# Altium schematic sheet Boost 12V.SchDoc
size A4; SheetNumber: 3; SheetTotal: 12
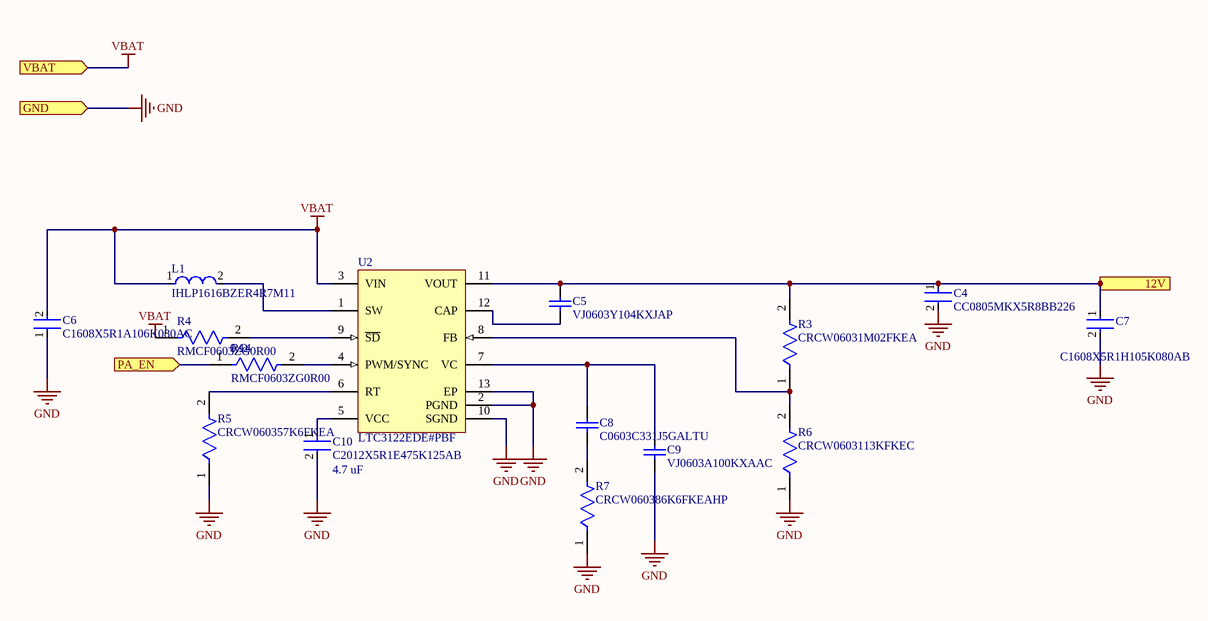
[diagram p0: Boost 12V.SchDoc]

## Parts
C4  CC0805MKX5R8BB226  [FP-CC0805-0_2-1_45-IPC_C]
C5  VJ0603Y104KXJAP  [CAPC1608X92X38NL15T08]
C6  C1608X5R1A106K080AC  [FP-C1608-080-0_1-MFG]
C7  C1608X5R1H105K080AB  [FP-C1608-080-0_1-IPC_B]
C8  C0603C331J5GALTU  [CAPC1608X87X35NL15T15]
C9  VJ0603A100KXAAC  [CAPC1608X92X38ML12T08]
C10  C2012X5R1E475K125AB  [FP-C2012-125-0_2-MFG]
L1  IHLP1616BZER4R7M11  [FP-IHLP-1616BZ-FP_1_8545x-MFG]
R3  CRCW06031M02FKEA  [FP-CRCW0603-e3-IPC_A]
R4  RMCF0603ZG0R00  [FP-RMCF0603-IPC_B]
R5  CRCW060357K6FKEA  [FP-CRCW0603-e3-MFG]
R6  CRCW0603113KFKEC  [FP-CRCW0603-e3-MFG]
R7  CRCW060386K6FKEAHP  [FP-CRCW0603-HPe3-MFG]
R14  RMCF0603ZG0R00  [FP-RMCF0603-IPC_B]
U2  LTC3122EDE#PBF  [LT-DE-UE-12_V]

## Ports
12V (out), GND (in), PA_EN (in), VBAT (in)

## Nets
GND: C4.2 C6.1 C7.2 C9.1 C10.2 R5.1 R6.1 R7.1 U2.2(PGND) U2.10(SGND) U2.13(EP) ; port GND
VBAT: C6.2 L1.1 R4.1 U2.3(VIN) ; port VBAT
12V: C4.1 C5.2 C7.1 R3.2 U2.11(VOUT) ; port 12V
PA_EN: R14.1 ; port PA_EN
NetC5_1: C5.1 U2.12(CAP)
NetC8_1: C8.1 R7.2
NetC8_2: C8.2 C9.2 U2.7(VC)
NetC10_1: C10.1 U2.5(VCC)
NetL1_2: L1.2 U2.1(SW)
NetR3_1: R3.1 R6.2 U2.8(FB)
NetR4_2: R4.2 U2.9(~{SD})
NetR5_2: R5.2 U2.6(RT)
NetR14_2: R14.2 U2.4(PWM/SYNC)

## Notes on the sheet
- 0 Ω
- (near C10) 4.7 uF

## Library data of the parts
C4 = CMP-03422-001497-1: CAP CER 22UF 25V X5R 0805; Tolerance: 20%; Max Operating Temperature: 85°C; Dielectric: X5R; Termination: SMD/SMT; Voltage Rating: 25V; Width: 0.049inch; Min Operating Temperature: -55°C; Case/Package: 0805; Lead Free: Lead Free; RoHS Compliant: Yes; Weight: 0.000194oz; Voltage Rating (DC): 25V; Capacitance: 22uF; Length: 0.079inch; Halogen Free: Halogen Free; Height: 1.25mm; Packaging: Tape and Reel; Package Quantity: 3000; Case Code (Metric): 2012; Thickness: 0.057inch; Case Code (Imperial): 0805; Mount: Surface Mount
C5 = CMP-2006-01211-1: Manufacturer: Vitramon; Part Number: VJ0603Y104KXJAP
C6 = CMP-2000-04979-3: Multilayer Ceramic Capacitors 10μF ±10% 10V X5R SMD 0603; Capacitance: 10uF; Dielectric Material: Ceramic; Construction: Flat; Height: 0.8mm; Thickness: 0.035inch; Case Code (Metric): 1608; Radiation Hardening: No; Number of Pins: 2; Voltage Rating (DC): 10V; Depth: 0.8mm; Voltage: 10V; RoHS Compliant: Yes; Voltage Rating: 10V; Package Quantity: 1; Resistor Type: Ceramic; Termination: SMD/SMT; Lead Free: Lead Free; REACH SVHC: No SVHC; Tolerance: 10%; Mount: Surface Mount; Series: C; Packaging: Tape and Reel; Width: 0.8mm; Dielectric: X5R; Weight: 7.1E-05oz; Length: 1.6mm; Max Operating Temperature: 85°C; Case Code (Imperial): 0603; Case/Package: 0603; Min Operating Temperature: -55°C
C7 = CMP-2000-06025-2: Multilayer Ceramic Capacitors 1μF ±10% 50V X5R SMD 0603; Capacitance: 1uF; Lead Free: Lead Free; Height: 0.8mm; Mount: Surface Mount; Radiation Hardening: No; Thickness: 0.035inch; Length: 1.6mm; Max Operating Temperature: 85°C; REACH SVHC: No SVHC; Min Operating Temperature: -55°C; Construction: Flat; RoHS Compliant: Yes; Voltage Rating: 50V; Dielectric: X5R; Packaging: Tape and Reel; Termination: SMD/SMT; Voltage Rating (DC): 50V; Case Code (Imperial): 0603; Voltage: 50V; Width: 0.031inch; Weight: 7.1E-05oz; Depth: 0.8mm; Case Code (Metric): 1608; Series: C; Case/Package: 0603; Tolerance: 10%; Resistor Type: Ceramic; Number of Pins: 2; Dielectric Material: Ceramic; Package Quantity: 1
C8 = CMP-2006-03564-1: Manufacturer: Kemet; Part Number: C0603C331J5GALTU
C9 = CMP-2006-02012-1: Manufacturer: Vitramon; Part Number: VJ0603A100KXAAC
C10 = CMP-08246-004908-1: Multilayer Ceramic Capacitors 4.7μF ±10% 25V X5R SMD 0805; Capacitance: 4.7uF; Lead Free: Lead Free; Thickness: 0.057inch; Packaging: Tape and Reel; Min Operating Temperature: -55°C; RoHS Compliant: Yes; Dielectric: X5R; Weight: 0.000194oz; REACH SVHC: No SVHC; Voltage Rating (DC): 25V; Mount: Surface Mount; Resistor Type: Ceramic; Termination: SMD/SMT; Number of Pins: 2; Case Code (Imperial): 0805; Dielectric Material: Ceramic; Voltage: 25V; Voltage Rating: 25V; Case Code (Metric): 2012; Case/Package: 0805; Max Operating Temperature: 85°C; Height: 1.25mm; Tolerance: 10%; Depth: 1.25mm; Package Quantity: 1; Length: 2mm; Radiation Hardening: No; Width: 1.25mm
L1 = CMP-02424-000576-1: Fixed Inductors Commercial Low DCR Series SMT 4.7uH 1.7A 105mΩ 20%; Saturation Current: 1.75A; Test Frequency: 100kHz; Shielding: Shielded; Self Resonant Frequency: 29MHz; Core Material: Ferrite; DC Resistance (DCR): 105mR; Width: 4.06mm; Depth: 4.31mm; Height: 2mm; Inductance: 4.7uH; Case/Package: 1616; Max DC Current: 1.7A; Max Operating Temperature: 125°C; Inductance Tolerance: 20%; Current Rating: 1.7A; Package Quantity: 4000; Tolerance: 20%; Length: 4.7mm; Contact Plating: Tin; RMS Current (Irms): 1.7A; Packaging: Tape and Reel; Height - Seated (Max): 0.079inch; Military Standard: Not; Termination: SMD/SMT; Mount: Surface Mount; Number of Pins: 1616; Min Operating Temperature: -55°C; Lead Free: Lead Free; Radiation Hardening: No
R3 = CMP-2000-03018-2: RES Thick Film, 1.02MΩ, 1%, 0.1W, 100ppm/°C, 0603; Voltage Rating (DC): 75V; Power Rating: 100mW; Resistance: 1.02MR; Features: Automotive AEC-Q200; Depth: 0.85mm; Max Operating Temperature: 155°C; Tolerance: 1%; Package Quantity: 10; Length: 1.55mm; Mount: Surface Mount; Termination: SMD/SMT; Width: 0.033inch; Temperature Coefficient: 100ppm/°C; Min Operating Temperature: -55°C; Composition: Thick Film; Max Power Dissipation: 100mW; Case Code (Imperial): 0603; Case/Package: 0603; Voltage Rating: 75V; Contact Plating: Tin; Case Code (Metric): 1608; Weight: 7.1E-05oz; Lead Free: Lead Free; Height: 0.02inch; Military Standard: Not; Number of Terminations: 2; Radiation Hardening: No; Packaging: Tape and Reel
R4 R14 = CMP-26527-006412-1: 0Ω ±0 0.1W 0603 Thick Film Chip Resistor AEC-Q200 compliant; Max Power Dissipation: 100mW; Resistance: 0R; Width: 0.031inch; RoHS Compliant: Yes; Number of Terminations: 2; Case/Package: 0603; Contact Plating: Tin; Height: 0.022inch; Resistor Type: Thick Film; Mount: Surface Mount; Length: 0.061inch; Features: Automotive AEC-Q200; Series: RMCF; Max Operating Temperature: 155°C; Radiation Hardening: No; Min Operating Temperature: -55°C; Packaging: Tape and Reel
R5 = CMP-2000-03475-2: RES Thick Film, 57.6kΩ, 1%, 0.1W, 100ppm/°C, 0603; Voltage Rating: 75V; Power Rating: 100mW; Resistance: 57.6kR; Case Code (Metric): 1608; Length: 1.55mm; Weight: 7.1E-05oz; Case/Package: 0603; Features: Automotive AEC-Q200; Contact Plating: Tin; Temperature Coefficient: 100ppm/°C; Number of Terminations: 2; Packaging: Tape and Reel; Package Quantity: 10; Max Power Dissipation: 100mW; Depth: 0.85mm; Height: 0.45mm; Tolerance: 1%; Radiation Hardening: No; Composition: Thick Film; Width: 0.85mm; Min Operating Temperature: -55°C; Case Code (Imperial): 0603; Termination: SMD/SMT; Number of Pins: 2; Max Operating Temperature: 155°C; Military Standard: Not
R6 = CMP-02407-003381-1: RES Thick Film, 113kΩ, 1%, 0.1W, 100ppm/°C, 0603; Power Rating: 100mW; Resistance: 113kR; Packaging: Tape and Reel; Width: 0.033inch; Lead Free: Lead Free; Case/Package: 0603; Height: 0.02inch; Length: 0.061inch; Max Power Dissipation: 100mW; Composition: Thick Film; Tolerance: 1%; Number of Terminations: 2; Max Operating Temperature: 155°C; Min Operating Temperature: -55°C; Temperature Coefficient: 100ppm/°C; Features: Automotive AEC-Q200; Package Quantity: 20000
R7 = CMP-02407-006337-1: RES Thick Film, 86.6kΩ, 1%, 0.33W, 100ppm/°C, 0603; Max Power Dissipation: 250mW; Resistance: 86.6kR; Tolerance: 1%; Width: 0.033inch; Package Quantity: 5000; Composition: Thick Film; Number of Terminations: 2; Height: 0.022inch; Length: 0.063inch; Temperature Coefficient: 100ppm/°C; Packaging: Tape and Reel; Features: Automotive AEC-Q200; Lead Free: Lead Free; Case/Package: 0603
U2 = CMP-0492-00369-1: 2.5 A Synchronous Step-Up DC/DC Converter with Output Disconnect, 12-pin SON (DE-UE-12), -40 to 125 degC, Pb-Free; Manufacturer: Linear Technology; Number of Outputs: 1; ComponentLink2URL: http://cds.linear.com/docs/en/datasheet/3122fa.pdf; ComponentLink1URL: http://www.linear.com/; Code_JEDEC: MO-229; ComponentLink2Description: Datasheet; ComponentLink1Description: Manufacturer URL; PackageReference: DE-UE-12; PackageVersion: Rev. D, 06/2010; ComponentLink3Description: Package Specification; PackageDescription: 12-Pin Plastic DFN, Body 4 x 3 mm, Pitch 0.5 mm; PartNumber: LTC3122EDE#PBF; ComponentLink3URL: http://cds.linear.com/docs/en/packaging/DFN_12_05-08-1695.pdf; Mounting Technology: Surface Mount; RoHS: TRUE; DatasheetVersion: Rev. A